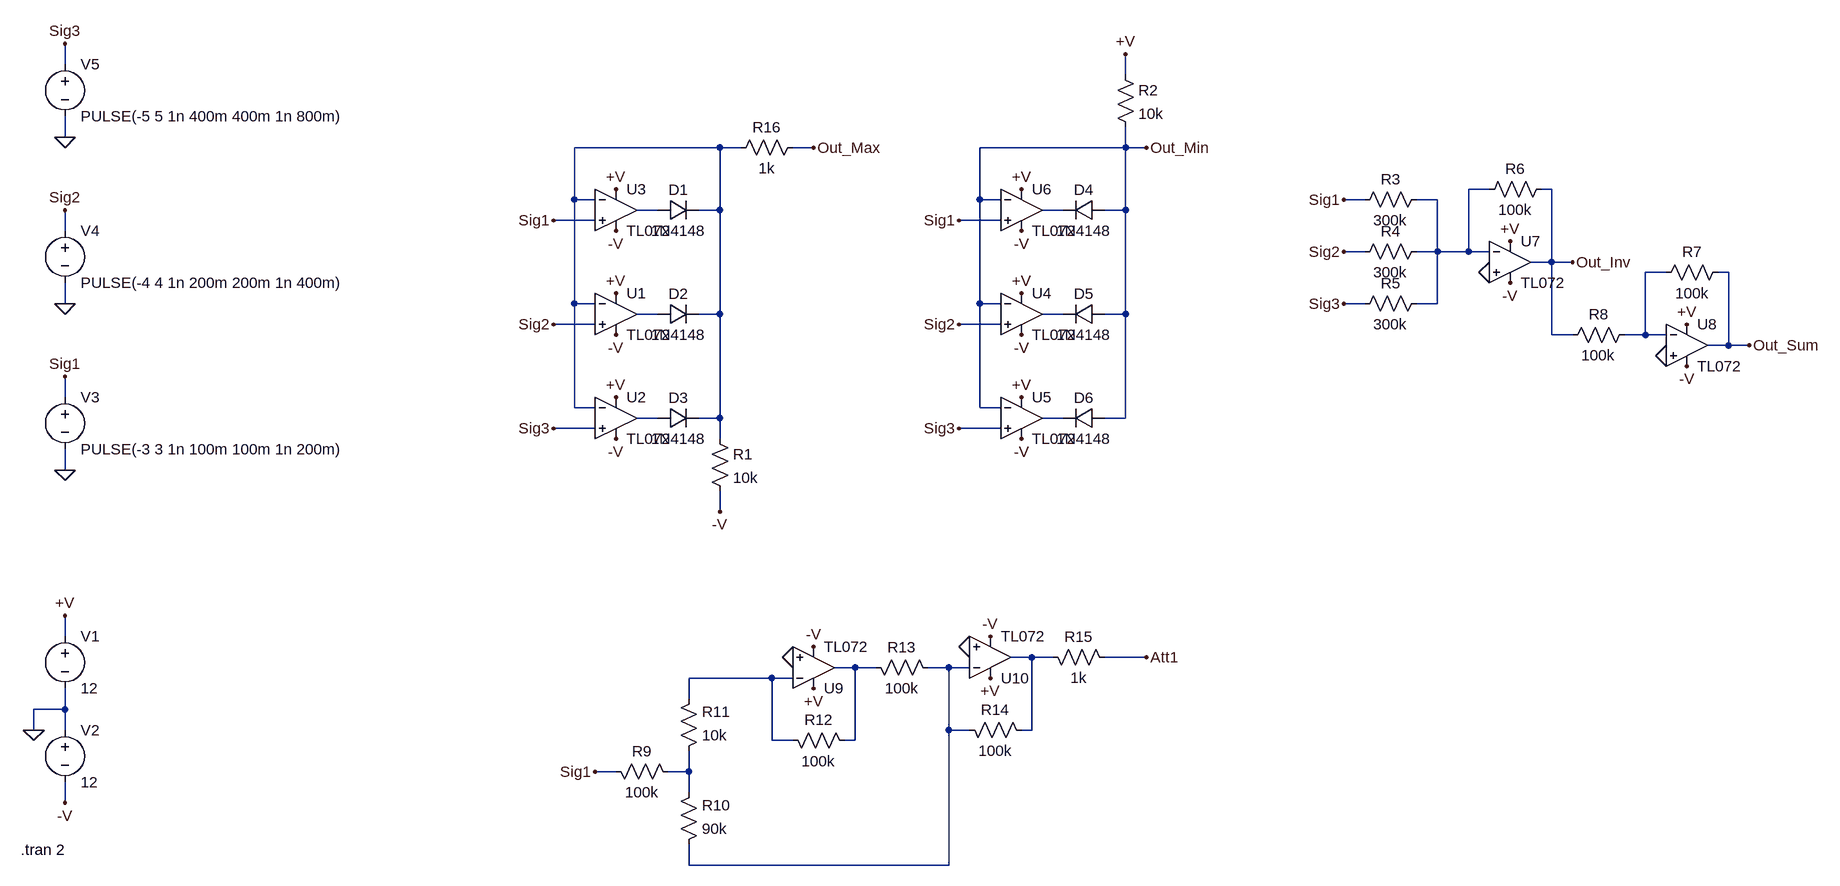
[diagram p0: schematic Min_Max.asc]
Min_Max.asc, the LTspice schematic file:
Version 4
SHEET 1 2700 680
WIRE -32 -736 -32 -768
WIRE 1600 -720 1600 -752
WIRE -32 -624 -32 -656
WIRE 976 -608 752 -608
WIRE 1008 -608 976 -608
WIRE 1120 -608 1088 -608
WIRE 1600 -608 1600 -640
WIRE 1600 -608 1376 -608
WIRE 1632 -608 1600 -608
WIRE 2160 -544 2128 -544
WIRE 2256 -544 2240 -544
WIRE 752 -528 752 -608
WIRE 784 -528 752 -528
WIRE 1376 -528 1376 -608
WIRE 1408 -528 1376 -528
WIRE 1968 -528 1936 -528
WIRE 2080 -528 2048 -528
WIRE 880 -512 848 -512
WIRE 976 -512 976 -608
WIRE 976 -512 944 -512
WIRE 1504 -512 1472 -512
WIRE 1600 -512 1600 -608
WIRE 1600 -512 1568 -512
WIRE 784 -496 720 -496
WIRE 1408 -496 1344 -496
WIRE -32 -480 -32 -512
WIRE 1968 -448 1936 -448
WIRE 2080 -448 2080 -528
WIRE 2080 -448 2048 -448
WIRE 2128 -448 2128 -544
WIRE 2128 -448 2080 -448
WIRE 2160 -448 2128 -448
WIRE 2256 -432 2256 -544
WIRE 2256 -432 2224 -432
WIRE 2288 -432 2256 -432
WIRE 2432 -416 2400 -416
WIRE 2528 -416 2512 -416
WIRE -32 -368 -32 -400
WIRE 752 -368 752 -528
WIRE 784 -368 752 -368
WIRE 1376 -368 1376 -528
WIRE 1408 -368 1376 -368
WIRE 1968 -368 1936 -368
WIRE 2080 -368 2080 -448
WIRE 2080 -368 2048 -368
WIRE 880 -352 848 -352
WIRE 976 -352 976 -512
WIRE 976 -352 944 -352
WIRE 1504 -352 1472 -352
WIRE 1600 -352 1600 -512
WIRE 1600 -352 1568 -352
WIRE 784 -336 720 -336
WIRE 1408 -336 1344 -336
WIRE 2256 -320 2256 -432
WIRE 2288 -320 2256 -320
WIRE 2400 -320 2400 -416
WIRE 2400 -320 2368 -320
WIRE 2432 -320 2400 -320
WIRE 2528 -304 2528 -416
WIRE 2528 -304 2496 -304
WIRE 2560 -304 2528 -304
WIRE -32 -224 -32 -256
WIRE 752 -208 752 -368
WIRE 784 -208 752 -208
WIRE 1376 -208 1376 -368
WIRE 1408 -208 1376 -208
WIRE 880 -192 848 -192
WIRE 976 -192 976 -352
WIRE 976 -192 944 -192
WIRE 1504 -192 1472 -192
WIRE 1600 -192 1600 -352
WIRE 1600 -192 1568 -192
WIRE 784 -176 720 -176
WIRE 1408 -176 1344 -176
WIRE 976 -160 976 -192
WIRE -32 -112 -32 -144
WIRE 976 -48 976 -80
WIRE -32 144 -32 112
WIRE 1456 176 1424 176
WIRE 1488 176 1456 176
WIRE 1632 176 1568 176
WIRE 1184 192 1152 192
WIRE 1216 192 1184 192
WIRE 1328 192 1296 192
WIRE 1360 192 1328 192
WIRE 1056 208 928 208
WIRE 1088 208 1056 208
WIRE 928 240 928 208
WIRE -32 256 -32 224
WIRE -32 256 -80 256
WIRE -80 288 -80 256
WIRE -32 288 -32 256
WIRE 1328 288 1328 192
WIRE 1360 288 1328 288
WIRE 1456 288 1456 176
WIRE 1456 288 1440 288
WIRE 1056 304 1056 208
WIRE 1088 304 1056 304
WIRE 1184 304 1184 192
WIRE 1184 304 1168 304
WIRE 816 352 784 352
WIRE 928 352 928 320
WIRE 928 352 896 352
WIRE 928 384 928 352
WIRE -32 400 -32 368
WIRE 928 496 928 464
WIRE 1328 496 1328 288
WIRE 1328 496 928 496
FLAG -32 112 +V
FLAG -80 288 0
FLAG -32 400 -V
FLAG -32 -256 Sig1
FLAG -32 -112 0
FLAG -32 -512 Sig2
FLAG -32 -368 0
FLAG -32 -768 Sig3
FLAG -32 -624 0
FLAG 816 -384 +V
FLAG 816 -320 -V
FLAG 816 -224 +V
FLAG 816 -160 -V
FLAG 816 -544 +V
FLAG 816 -480 -V
FLAG 720 -496 Sig1
FLAG 720 -336 Sig2
FLAG 720 -176 Sig3
FLAG 1120 -608 Out_Max
FLAG 1440 -384 +V
FLAG 1440 -320 -V
FLAG 1440 -224 +V
FLAG 1440 -160 -V
FLAG 1440 -544 +V
FLAG 1440 -480 -V
FLAG 1344 -496 Sig1
FLAG 1344 -336 Sig2
FLAG 1344 -176 Sig3
FLAG 1632 -608 Out_Min
FLAG 1600 -752 +V
FLAG 976 -48 -V
FLAG 1936 -528 Sig1
FLAG 1936 -448 Sig2
FLAG 1936 -368 Sig3
FLAG 2192 -464 +V
FLAG 2192 -400 -V
FLAG 2160 -416 0
FLAG 2288 -432 Out_Inv
FLAG 2464 -336 +V
FLAG 2464 -272 -V
FLAG 2432 -288 0
FLAG 2560 -304 Out_Sum
FLAG 784 352 Sig1
FLAG 1120 224 +V
FLAG 1120 160 -V
FLAG 1632 176 Att1
FLAG 1088 176 0
FLAG 1392 208 +V
FLAG 1392 144 -V
FLAG 1360 160 0
SYMBOL voltage -32 128 R0
SYMATTR InstName V1
SYMATTR Value 12
SYMBOL voltage -32 272 R0
SYMATTR InstName V2
SYMATTR Value 12
SYMBOL voltage -32 -240 R0
WINDOW 123 0 0 Left 0
WINDOW 39 0 0 Left 0
SYMATTR InstName V3
SYMATTR Value PULSE(-3 3 1n 100m 100m 1n 200m)
SYMBOL voltage -32 -496 R0
WINDOW 123 0 0 Left 0
WINDOW 39 0 0 Left 0
SYMATTR InstName V4
SYMATTR Value PULSE(-4 4 1n 200m 200m 1n 400m)
SYMBOL voltage -32 -752 R0
WINDOW 123 0 0 Left 0
WINDOW 39 0 0 Left 0
SYMATTR InstName V5
SYMATTR Value PULSE(-5 5 1n 400m 400m 1n 800m)
SYMBOL Own\ Elements\\OpAmps\\TL072 816 -416 R0
SYMATTR InstName U1
SYMBOL Own\ Elements\\OpAmps\\TL072 816 -256 R0
SYMATTR InstName U2
SYMBOL Own\ Elements\\OpAmps\\TL072 816 -576 R0
SYMATTR InstName U3
SYMBOL diode 880 -496 R270
WINDOW 0 32 32 VTop 2
WINDOW 3 0 32 VBottom 2
SYMATTR InstName D1
SYMATTR Value 1N4148
SYMBOL diode 880 -336 R270
WINDOW 0 32 32 VTop 2
WINDOW 3 0 32 VBottom 2
SYMATTR InstName D2
SYMATTR Value 1N4148
SYMBOL diode 880 -176 R270
WINDOW 0 32 32 VTop 2
WINDOW 3 0 32 VBottom 2
SYMATTR InstName D3
SYMATTR Value 1N4148
SYMBOL res 960 -176 R0
SYMATTR InstName R1
SYMATTR Value 10k
SYMBOL Own\ Elements\\OpAmps\\TL072 1440 -416 R0
SYMATTR InstName U4
SYMBOL Own\ Elements\\OpAmps\\TL072 1440 -256 R0
SYMATTR InstName U5
SYMBOL Own\ Elements\\OpAmps\\TL072 1440 -576 R0
SYMATTR InstName U6
SYMBOL diode 1568 -496 M270
WINDOW 0 32 32 VTop 2
WINDOW 3 0 32 VBottom 2
SYMATTR InstName D4
SYMATTR Value 1N4148
SYMBOL diode 1568 -336 M270
WINDOW 0 32 32 VTop 2
WINDOW 3 0 32 VBottom 2
SYMATTR InstName D5
SYMATTR Value 1N4148
SYMBOL diode 1568 -176 M270
WINDOW 0 32 32 VTop 2
WINDOW 3 0 32 VBottom 2
SYMATTR InstName D6
SYMATTR Value 1N4148
SYMBOL res 1584 -736 R0
SYMATTR InstName R2
SYMATTR Value 10k
SYMBOL res 2064 -544 R90
WINDOW 0 0 56 VBottom 2
WINDOW 3 32 56 VTop 2
SYMATTR InstName R3
SYMATTR Value 300k
SYMBOL res 2064 -464 R90
WINDOW 0 0 56 VBottom 2
WINDOW 3 32 56 VTop 2
SYMATTR InstName R4
SYMATTR Value 300k
SYMBOL res 2064 -384 R90
WINDOW 0 0 56 VBottom 2
WINDOW 3 32 56 VTop 2
SYMATTR InstName R5
SYMATTR Value 300k
SYMBOL Own\ Elements\\OpAmps\\TL072 2192 -496 R0
SYMATTR InstName U7
SYMBOL res 2256 -560 R90
WINDOW 0 0 56 VBottom 2
WINDOW 3 32 56 VTop 2
SYMATTR InstName R6
SYMATTR Value 100k
SYMBOL Own\ Elements\\OpAmps\\TL072 2464 -368 R0
SYMATTR InstName U8
SYMBOL res 2528 -432 R90
WINDOW 0 0 56 VBottom 2
WINDOW 3 32 56 VTop 2
SYMATTR InstName R7
SYMATTR Value 100k
SYMBOL res 2384 -336 R90
WINDOW 0 0 56 VBottom 2
WINDOW 3 32 56 VTop 2
SYMATTR InstName R8
SYMATTR Value 100k
SYMBOL Own\ Elements\\OpAmps\\TL072 1120 256 M180
SYMATTR InstName U9
SYMBOL res 912 368 M270
WINDOW 0 32 56 VTop 2
WINDOW 3 0 56 VBottom 2
SYMATTR InstName R9
SYMATTR Value 100k
SYMBOL res 912 336 M180
WINDOW 0 36 76 Left 2
WINDOW 3 36 40 Left 2
SYMATTR InstName R11
SYMATTR Value 10k
SYMBOL res 912 480 M180
WINDOW 0 36 76 Left 2
WINDOW 3 36 40 Left 2
SYMATTR InstName R10
SYMATTR Value 90k
SYMBOL res 1184 320 M270
WINDOW 0 32 56 VTop 2
WINDOW 3 0 56 VBottom 2
SYMATTR InstName R12
SYMATTR Value 100k
SYMBOL res 1312 208 M270
WINDOW 0 32 56 VTop 2
WINDOW 3 0 56 VBottom 2
SYMATTR InstName R13
SYMATTR Value 100k
SYMBOL Own\ Elements\\OpAmps\\TL072 1392 240 M180
SYMATTR InstName U10
SYMBOL res 1456 304 M270
WINDOW 0 32 56 VTop 2
WINDOW 3 0 56 VBottom 2
SYMATTR InstName R14
SYMATTR Value 100k
SYMBOL res 1584 192 M270
WINDOW 0 32 56 VTop 2
WINDOW 3 0 56 VBottom 2
SYMATTR InstName R15
SYMATTR Value 1k
SYMBOL res 1104 -624 R90
WINDOW 0 0 56 VBottom 2
WINDOW 3 32 56 VTop 2
SYMATTR InstName R16
SYMATTR Value 1k
TEXT -100 472 Left 2 !.tran 2

The netlist it stands for:
* Min_Max.asc
V1 +V 0 12
V2 0 -V 12
V3 Sig1 0 PULSE(-3 3 1n 100m 100m 1n 200m)
V4 Sig2 0 PULSE(-4 4 1n 200m 200m 1n 400m)
V5 Sig3 0 PULSE(-5 5 1n 400m 400m 1n 800m)
* U1: TL072 (symbol Own Elements\OpAmps\TL072 not available, pins judged from their places): In+=Sig2 In-=N001 V+=+V V-=-V OUT=N006
* U2: TL072 (symbol Own Elements\OpAmps\TL072 not available, pins judged from their places): In+=Sig3 In-=N001 V+=+V V-=-V OUT=N008
* U3: TL072 (symbol Own Elements\OpAmps\TL072 not available, pins judged from their places): In+=Sig1 In-=N001 V+=+V V-=-V OUT=N003
D1 N003 N001 1N4148
D2 N006 N001 1N4148
D3 N008 N001 1N4148
R1 N001 -V 10k
* U4: TL072 (symbol Own Elements\OpAmps\TL072 not available, pins judged from their places): In+=Sig2 In-=Out_Min V+=+V V-=-V OUT=N007
* U5: TL072 (symbol Own Elements\OpAmps\TL072 not available, pins judged from their places): In+=Sig3 In-=Out_Min V+=+V V-=-V OUT=N009
* U6: TL072 (symbol Own Elements\OpAmps\TL072 not available, pins judged from their places): In+=Sig1 In-=Out_Min V+=+V V-=-V OUT=N004
D4 Out_Min N004 1N4148
D5 Out_Min N007 1N4148
D6 Out_Min N009 1N4148
R2 +V Out_Min 10k
R3 N002 Sig1 300k
R4 N002 Sig2 300k
R5 N002 Sig3 300k
* U7: TL072 (symbol Own Elements\OpAmps\TL072 not available, pins judged from their places): In+=0 In-=N002 V+=+V V-=-V OUT=Out_Inv
R6 Out_Inv N002 100k
* U8: TL072 (symbol Own Elements\OpAmps\TL072 not available, pins judged from their places): In+=0 In-=N005 V+=+V V-=-V OUT=Out_Sum
R7 Out_Sum N005 100k
R8 N005 Out_Inv 100k
* U9: TL072 (symbol Own Elements\OpAmps\TL072 not available, pins judged from their places): In+=0 In-=N013 V+=+V V-=-V OUT=N011
R9 N014 Sig1 100k
R11 N014 N013 10k
R10 N012 N014 90k
R12 N011 N013 100k
R13 N012 N011 100k
* U10: TL072 (symbol Own Elements\OpAmps\TL072 not available, pins judged from their places): In+=0 In-=N012 V+=+V V-=-V OUT=N010
R14 N010 N012 100k
R15 Att1 N010 1k
R16 Out_Max N001 1k
.model D D
.lib standard.dio
.tran 2
.backanno
.end